# EAGLE design PiTFT32 (EAGLE 9.6.2)

## Sheet 1 of 2
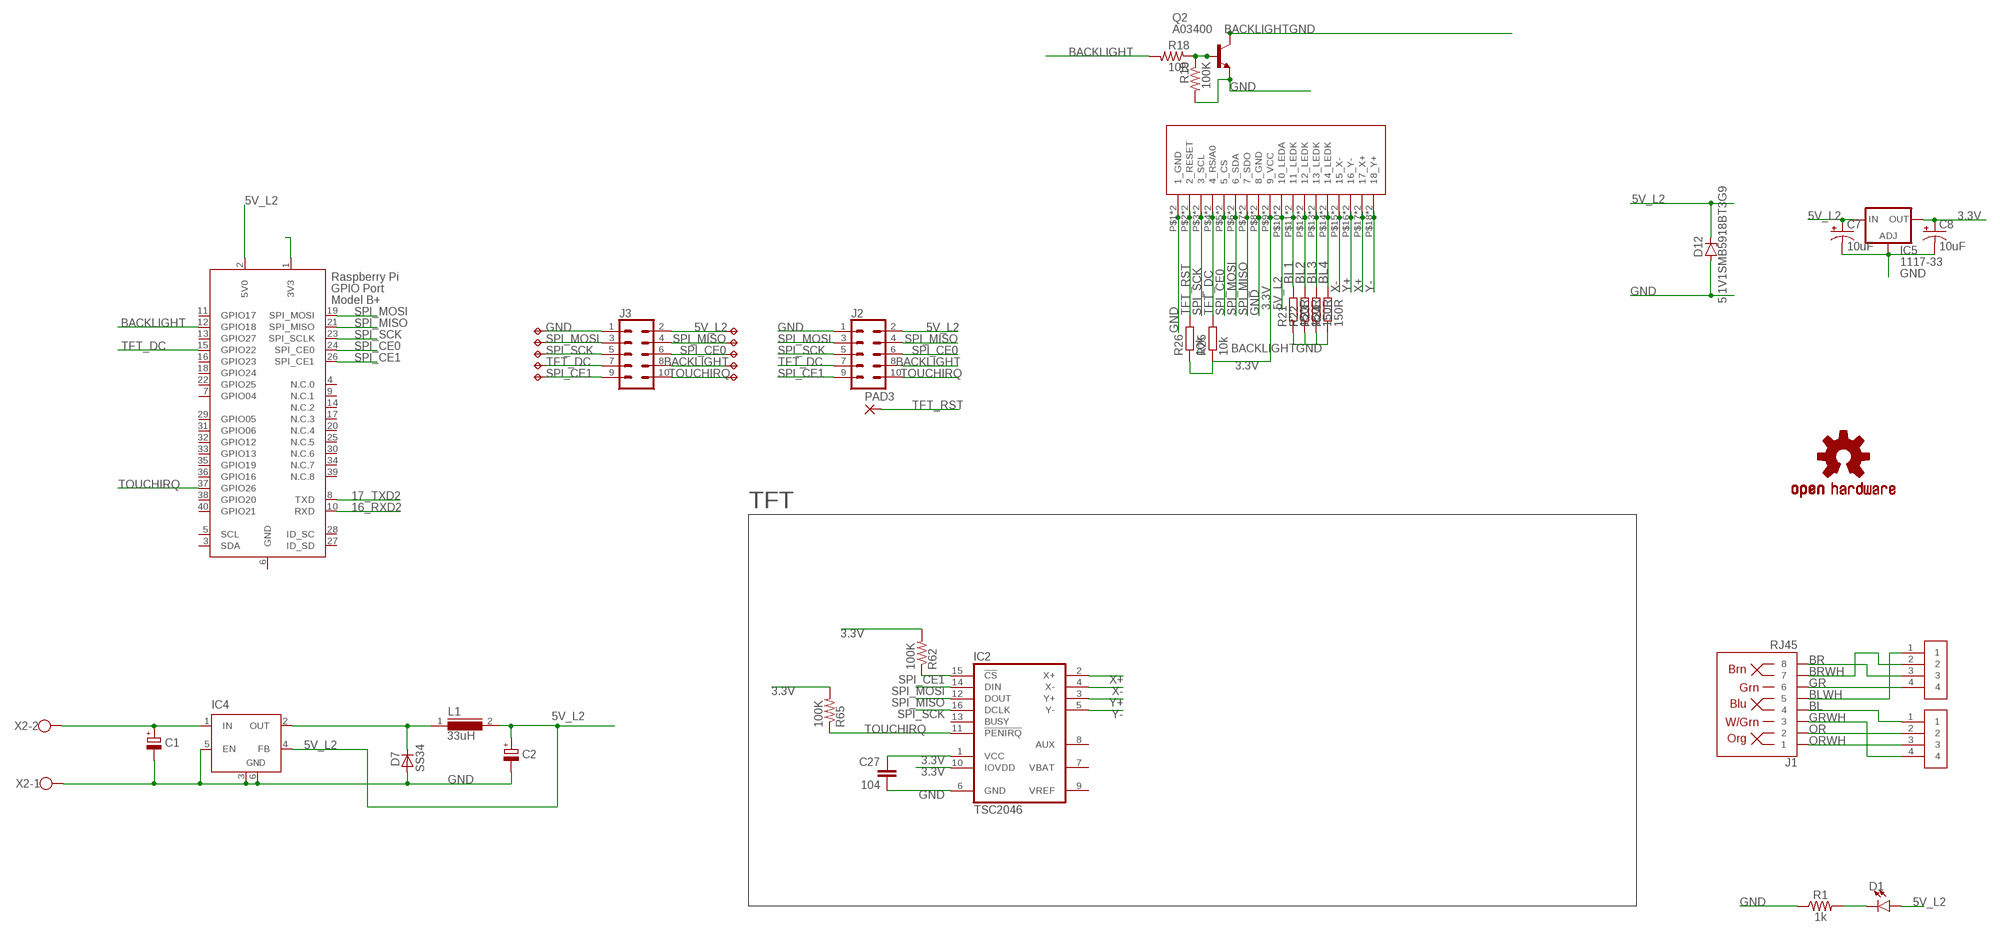
[diagram p0: schematic, sheet 1]

### Parts
C1  CPOL-EUE3.5-8  [E3,5-8]
C2  CPOL-EUE3.5-8  [E3,5-8]
C7  10uF  CAP_POL1206  [EIA3216]
C8  10uF  CAP_POL1206  [EIA3216]
C27  104  C-EUC0603K  [C0603K]
CON1  Phoenix Pluggable 3.81mm 4 way  CONNECTOR-M4  [3.81MM-4WAY-PLUGGABLE-SCREW]
CON25  Phoenix Pluggable 3.81mm 4 way  CONNECTOR-M4  [3.81MM-4WAY-PLUGGABLE-SCREW]
D1  LED5MM  [LED_5MM]
D7  SS34  D-SOD-87  [SOD87]
D12  5.1V1SMB5918BT3G9  ZENER-DIODESMB  [SMB]
IC2  TSC2046  [TSSOP16]
IC4  LM2596S  [TO263-5]
IC5  1117-33  LD117AS33TR  [SOT223]
J1  RJ45  RJ45-8  [RJ45-8]
J2  CONN_05X2SHD  [2X5-SHROUDED]
J3  CONN_05X2SHD  [2X5-SHROUDED]
L1  33uH  DR127  [DR127]
LOGO1  OSHW-LOGOM  [OSHW-LOGO-M]
PAD3  SMD5  [SMD2,54-5,08]
Q2  A03400  BC849SMD  [SOT23-BEC]
R1  1k  1KOHM-HORIZ_KIT-1/4W-5%  [AXIAL-0.3-KIT]
R18  10R  R-US_R0603  [R0603]
R19  100K  R-US_R0603  [R0603]
R21  150R  R-EU_0603-RND  [R0603-ROUND]
R22  150R  R-EU_R0603  [R0603-ROUND]
R23  150R  R-EU_R0603  [R0603-ROUND]
R24  150R  R-EU_R0603  [R0603-ROUND]
R25  10k  R-EU_R0603  [R0603-ROUND]
R26  10k  R-EU_R0603  [R0603-ROUND]
R62  100K  R-US_R0603  [R0603]
R65  100K  R-US_R0603  [R0603]
TP1  TPB1,27  [B1,27]
TP2  TPB1,27  [B1,27]
TP3  TPB1,27  [B1,27]
TP4  TPB1,27  [B1,27]
TP5  TPB1,27  [B1,27]
TP6  TPB1,27  [B1,27]
TP7  TPB1,27  [B1,27]
TP8  TPB1,27  [B1,27]
TP9  TPB1,27  [B1,27]
TP10  TPB1,27  [B1,27]
U$5  TFT-DISPLAY-3.2-OB  [TFT-DISPLAY-3.2-OB]
X1  RASPI_BOARD_B+_E0  [RASPI_BOARD_B+_EDGES_0DRILL]
X2  W237-102  [W237-102]

### Nets
3.3V: C8.A(+) C27.1 IC2.1(VCC) IC2.10(IOVDD) IC5.4(OUT) R25.1 R26.1 R62.2 R65.2 U$5.P$9(9_VCC) U$5.P$27(9_VCC)
5V_L2: C2.+ C7.A(+) D1.A D12.C IC4.4(FB) IC5.3(IN) J2.2 J3.2 L1.2 TP6.TP U$5.P$10(10_LEDA) U$5.P$28(10_LEDA) X1.2(5V0)
16_RXD2: X1.10(RXD)
17_TXD2: X1.8(TXD)
BACKLIGHT: J2.8 J3.8 R18.2 TP9.TP X1.12(GPIO18)
BACKLIGHTGND: Q2.C R21.1 R22.1 R23.1 R24.1
BL: CON1.1 J1.4
BL1: R21.2 U$5.P$11(11_LEDK) U$5.P$29(11_LEDK)
BL2: R22.2 U$5.P$12(12_LEDK) U$5.P$30(12_LEDK)
BL3: R23.2 U$5.P$13(13_LEDK) U$5.P$31(13_LEDK)
BL4: R24.2 U$5.P$14(14_LEDK) U$5.P$32(14_LEDK)
BLWH: CON25.1 J1.5
BR: CON25.3 J1.8
BRWH: CON25.2 J1.7
GND: C1.- C2.- C7.C(-) C8.C(-) C27.2 D7.2(A) D12.A IC2.6(GND) IC4.3(GND) IC4.5(EN) IC4.6(GND) IC5.1(ADJ) J2.1 J3.1 Q2.E R1.P$1 R19.2 TP1.TP U$5.P$1(1_GND) U$5.P$8(8_GND) U$5.P$19(1_GND) U$5.P$26(8_GND) X2.1
GR: CON25.4 J1.6
GRWH: CON1.4 J1.3
HI-V-IN: C1.+ IC4.1(IN) X2.2
N$1: X1.1(3V3)
N$2: D1.K(C) R1.P$2
N$3: Q2.B R18.1 R19.1
N$8: D7.1(C) IC4.2(OUT) L1.1
OR: CON1.2 J1.2
ORWH: CON1.3 J1.1
SPI_CE0: J2.6 J3.6 TP8.TP U$5.P$5(5_CS) U$5.P$23(5_CS) X1.24(SPI_CE0)
SPI_CE1: IC2.15(!CS) J2.9 J3.9 R62.1 TP5.TP X1.26(SPI_CE1)
SPI_MISO: IC2.12(DOUT) J2.4 J3.4 TP7.TP U$5.P$7(7_SDO) U$5.P$25(7_SDO) X1.21(SPI_MISO)
SPI_MOSI: IC2.14(DIN) J2.3 J3.3 TP2.TP U$5.P$6(6_SDA) U$5.P$24(6_SDA) X1.19(SPI_MOSI)
SPI_SCK: IC2.16(DCLK) J2.5 J3.5 TP3.TP U$5.P$3(3_SCL) U$5.P$21(3_SCL) X1.23(SPI_SCLK)
TFT_DC: J2.7 J3.7 R25.2 TP4.TP U$5.P$4(4_RS/A0) U$5.P$22(4_RS/A0) X1.15(GPIO22)
TFT_RST: PAD3.1(P) R26.2 U$5.P$2(2_RESET) U$5.P$20(2_RESET)
TOUCHIRQ: IC2.11(!PENIRQ) J2.10 J3.10 R65.1 TP10.TP X1.37(GPIO26)
X+: IC2.2(X+) U$5.P$17(17_X+) U$5.P$35(17_X+)
X-: IC2.4(X-) U$5.P$15(15_X-) U$5.P$33(15_X-)
Y+: IC2.3(Y+) U$5.P$16(16_Y-) U$5.P$34(16_Y-)
Y-: IC2.5(Y-) U$5.P$18(18_Y+) U$5.P$36(18_Y+)
Unconnected: IC2.7(VBAT) IC2.8(AUX) IC2.9(VREF) IC2.13(BUSY) X1.3(SDA) X1.4(N.C.0) X1.5(SCL) X1.7(GPIO04) X1.9(N.C.1) X1.11(GPIO17) X1.13(GPIO27) X1.14(N.C.2) X1.16(GPIO23) X1.17(N.C.3) X1.18(GPIO24) X1.20(N.C.4) X1.22(GPIO25) X1.25(N.C.5) X1.27(ID_SD) X1.28(ID_SC) X1.29(GPIO05) X1.30(N.C.6) X1.31(GPIO06) X1.32(GPIO12) X1.33(GPIO13) X1.34(N.C.7) X1.35(GPIO19) X1.36(GPIO16) X1.38(GPIO20) X1.39(N.C.8) X1.40(GPIO21)

### Notes on the sheet
- TFT

## Sheet 2 of 2

## Power pins joined to a net without a drawn wire
GND: X1.6(GND)

## Library data of the parts
C1 C2 = resistor:CPOL-EU: POLARIZED CAPACITOR, European symbol
C7 C8 = SparkFun:CAP_POL: Capacitor Polarized These are standard SMD and PTH capacitors. Normally 10uF, 47uF, and 100uF in electrolytic and tantalum varieties. Always verify the external diameter of the through hole cap, it varies with capacity, voltage, and manufacturer. The EIA devices should be standard.
C27 = SmartPrj:C-EU: CAPACITOR, European symbol
CON1 CON25 = openbuilds-eagle-library:CONNECTOR-M4
D1 = SparkFun-LED:LED: LED (Generic) Standard schematic elements and footprints for 5mm, 3mm, 1206, and 0603 sized LEDs. Generic LEDs with no color specified.
D7 = semicon-smd-ipc:D-: DIODE unfilled
D12 = diode:ZENER-DIODE: Z-Diode
IC2 = TSC2046:TSC2046: ADS7846 Touch Screen Controller
IC4 = linear:LM2596S: STEP-DOWN VOLTAGE REGULATOR
IC5 = v-reg:LD117A?*: Low drop fixed and adjustable positive voltage regulators 1 A Source: http://www.st.com/stonline/products/literature/ds/7194/ld1117axx.pdf
J1 = SparkFun-Connectors:RJ45-8: RJ45 Jack - 8 pin Simple RJ45, 8-pin connection. Commonly used for Cat5, Cat5e, and Cat6 Ethernet cables. Here is the connector we sell at SparkFun: RJ45 8-Pin Connector <https://www.sparkfun.com/products/643> (PRT-00643) Datasheet <https://cdn.sparkfun.com/datasheets/Prototyping/04908.pdf> It is used on this SparkFun product: SparkFun RJ45 Breakout <https://www.sparkfun.com/products/716> (BOB-00716) Note, you may also be interested in the "MAGJACK" version of this. It is basically a RJ45 connector, but also has some status LEDs built into the connector housing. You can check that out in this library at the device named "MAGJACK.dev" and see these products online: RJ45 Ethernet MagJack-Compatible <https://www.sparkfun.com/products/8534> (PRT-08534) SparkFun RJ45 MagJack Breakout <https://www.sparkfun.com/products/13021> (BOB-13021); PROD_ID: CONN-08506; SF_ID: PRT-00643
J2 J3 = SparkFun-Connectors:CONN_05X2: Multi connection point. Often used as Generic Header-pin footprint for 0.1 inch spaced/style header connections For AVR SPI programming port, see special device with nice symbol: "AVR_SPI_PROG_5x2.dev" You can populate with any combo of single row headers, but if you'd like an exact match, check these: 2x5 AVR ICSP Male Header <https://www.sparkfun.com/products/778> (PRT-00778) 2x5 Pin Shrouded Header <https://www.sparkfun.com/products/8506> (PRT-08506) On any of the 0.1 inch spaced packages, you can populate with these: Break Away Headers - Straight <https://www.sparkfun.com/products/116> (PRT-00116) Break Away Male Headers - Right Angle <https://www.sparkfun.com/products/553> (PRT-00553) Female Headers <https://www.sparkfun.com/products/115> (PRT-00115) Break Away Headers - Machine Pin <https://www.sparkfun.com/products/117> (PRT-00117) Break Away Female Headers - Swiss Machine Pin <https://www.sparkfun.com/products/743> (PRT-00743) Special note: the shrouded connector mates well with our 5x2 ribbon cables: 2x5 Pin IDC Ribbon Cable <https://www.sparkfun.com/products/8535> (PRT-08535); PROD_ID: CONN-08671; SF_ID: PRT-08506
L1 = inductors:DR127: High Power Density, High Efficiency, Shielded Inductors Source: coiltronics_dr_series.pdf
LOGO1 = SparkFun-Aesthetics:OSHW-LOGO: Open-Source Hardware (OSHW) Logo This logo indicates the piece of hardware it is found on incorporates a OSHW license and/or adheres to the definition of open source hardware found here: http://freedomdefined.org/OSHW
PAD3 = wirepad:SMD5: SMD PAD
Q2 = transistor-npn:BC849*: NPN Transistor
R1 = SparkFun-Resistors:1KOHM: 1kΩ resistor A resistor is a passive two-terminal electrical component that implements electrical resistance as a circuit element. Resistors act to reduce current flow, and, at the same time, act to lower voltage levels within circuits. - Wikipedia; PROD_ID: RES-08380
R18 R19 R62 R65 = adafruit:R-US_: RESISTOR, American symbol
R21-R26 = SmartPrj:R-EU_: RESISTOR, European symbol
TP1-TP10 = testpad:TP: Test pad
U$5 = tft32:TFT-DISPLAY-3.2-OB
X1 = raspberrypi_bastelstube_v13:RASPI_BOARD_B+: Raspberry Pi GPIO connector with markings for the outer dimensions of the Raspberry Pi board model B+ with different sets of drill holes or mounting pads
X2 = con-wago-500:W237-102: WAGO SCREW CLAMP; MPN: 237-102; OC_FARNELL: unknown; OC_NEWARK: 70K9898

## Net classes
0 default: width 0.203 mm, clearance 0.152 mm
1 power: width 0.254 mm

## Board
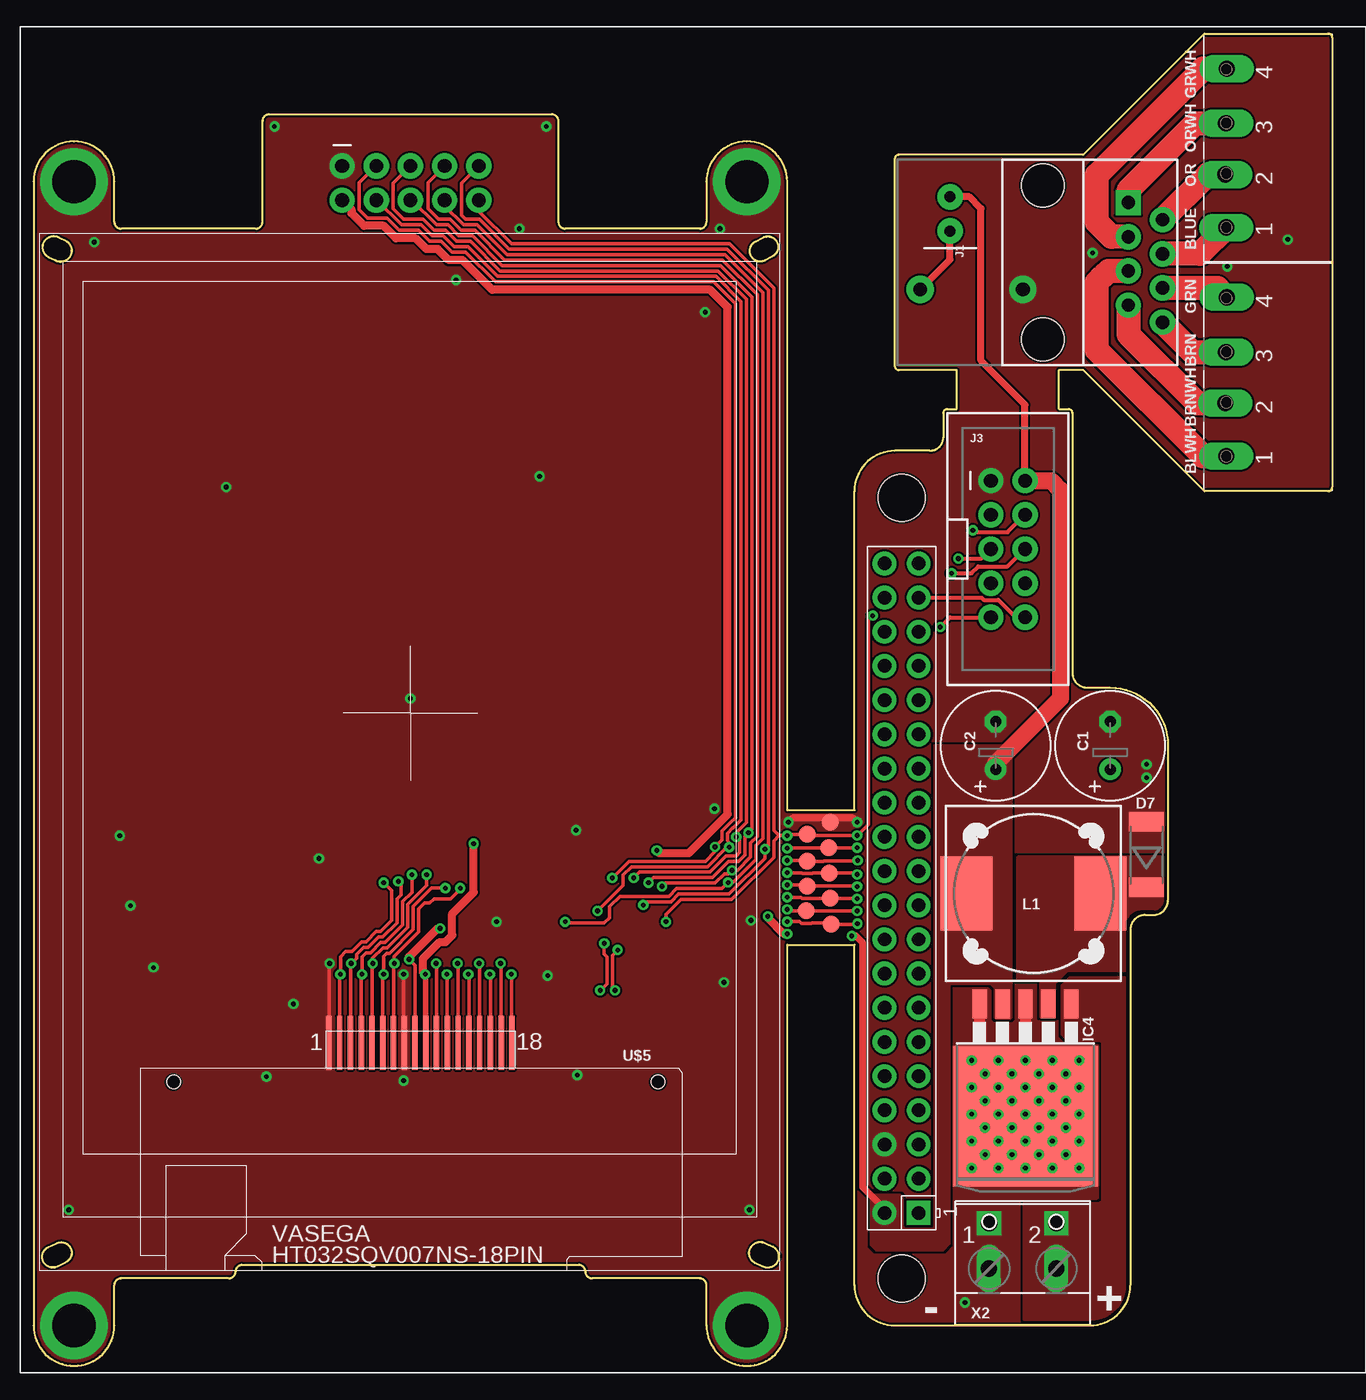
[diagram p1: board, top side]
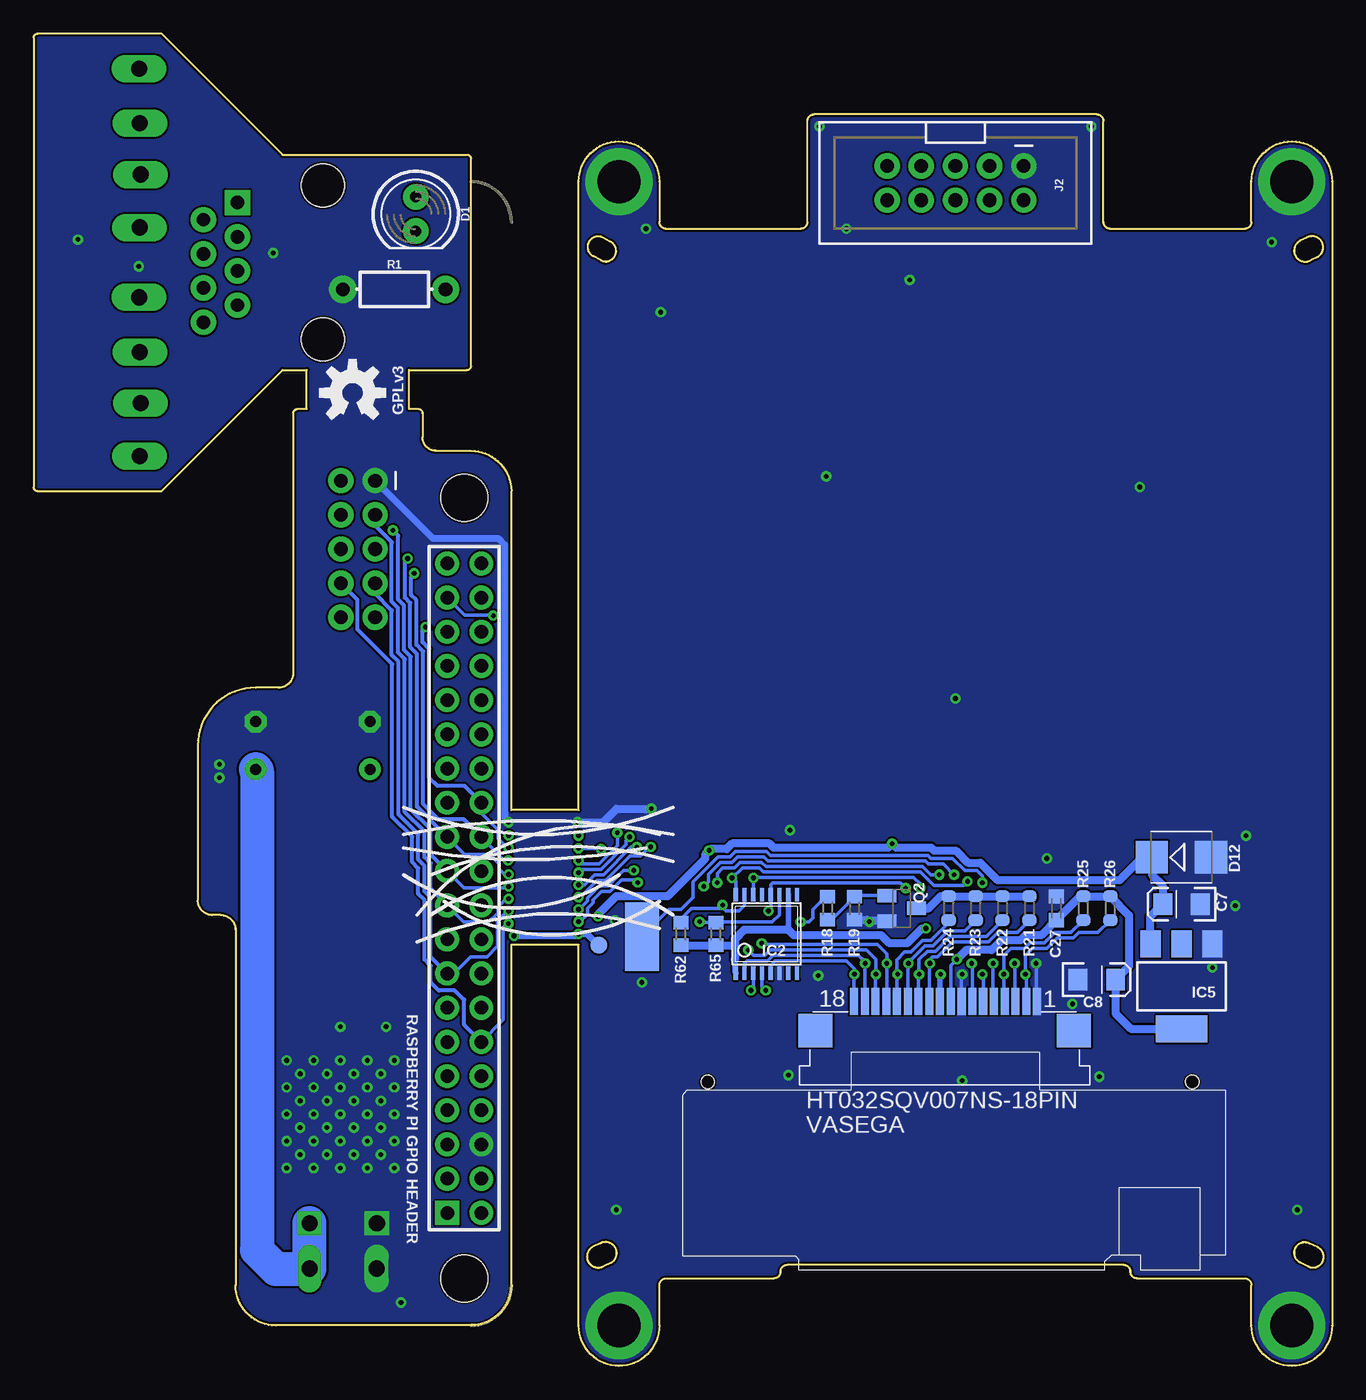
[diagram p2: board, bottom side, seen from below]

Size 96.5 x 99 mm. Coordinates in mm from the lower left corner, seen from the top.
Outline: 64,3 78.5,3 arc90 81.5,6 81.5,32.4 arc-90 82.6,33.5 83.2,33.5 arc90 84.3,34.6 84.3,46.1 arc90 80,50.4 78.3,50.4 arc-90 77.2,51.5 77.2,70.8 arc90 76.9,71.1 76.2,71.1 76.2,74 78,74 87,65 96.2,65 arc90 96.5,65.3 96.5,98.7 arc90 96.2,99 87,99 78,90 64.3,90 arc90 64,89.7 64,74.3 arc90 64.3,74 68.6,74 68.6,71.1 67.9,71.1 arc90 67.6,70.8 67.6,69 arc-90 66.6,68 64,68 arc90 61,65 61,41.3 56,41.3 56,88 arc180 50,88 50,85 arc-90 49.5,84.5 39.5,84.5 arc-90 39,85 39,92.5 arc90 38.5,93 17.5,93 arc90 17,92.5 17,85 arc-90 16.5,84.5 6.5,84.5 arc-90 6,85 6,88 arc180 0,88 0,3 arc180 6,3 6,6 arc-90 6.5,6.5 14.5,6.5 arc90 15,7 arc-90 15.5,7.5 40.5,7.5 arc-90 41,7 arc90 41.5,6.5 49.5,6.5 arc-90 50,6 50,3 arc180 56,3 56,31.3 61,31.3 61,6 arc90 64,3
Copper layers (1*16): Top 0.035mm / dielectric 1.5mm / Bottom 0.035mm
Design rules "default *": minimum track width 6mil, minimum drill 0.35mm, track to track 6mil, track to pad 6mil, pad to pad 6mil, via to via 6mil, smd to smd 6mil, copper to edge 6mil, drill to drill 6mil, minimum pad ring 10mil, minimum via ring 8mil, stop-mask expansion 4mil, vias tented up to drill 0mil, thermal gap 10mil
Holes 3.5 mm at 64.5,6.5 64.5,64.5

### Footprints (pad centres in the part's own frame; a part is rotated, then mirrored left to right if it is on the bottom)
E3,5-8 = drill 0.813 pad 1.6: + -1.778,0 | drill 0.813 pad 1.6 octagon: - 1.778,0
EIA3216 = smd 1.4 x 1.6: A 1.4,0; C -1.4,0
C0603K = smd 1.05 x 1.08: 1 -0.875,0; 2 0.875,0
3.81MM-4WAY-PLUGGABLE-SCREW = drill 1.2 pad 2.032 long: 1 5.905,-7.874; 2 1.968,-7.945; 3 -1.841,-7.889; 4 -5.905,-7.833
LED_5MM = drill 0.813 pad 1.88: A -1.27,0; K 1.27,0
SOD87 = smd 1.45 x 2.6: 1 -2.445,0; 2 2.445,0
SMB = smd 2.4 x 2.4: A 2.2,0; C -2.2,0
TSSOP16 = smd 0.305 x 0.991: 1 -2.925,-2.918; 2 -2.275,-2.918; 3 -1.625,-2.918; 4 -0.975,-2.918; 5 -0.325,-2.918; 6 0.325,-2.918; 7 0.975,-2.918; 8 1.625,-2.918; 9 1.625,2.918; 10 0.975,2.918; 11 0.325,2.918; 12 -0.325,2.918; 13 -0.975,2.918; 14 -1.625,2.918; 15 -2.275,2.918; 16 -2.925,2.918
TO263-5 = smd 1.067 x 2.159: 1 -3.404,-5.791; 2 -1.702,-5.791; 3 0,-5.791; 4 1.702,-5.791; 5 3.404,-5.791 | smd 10.8 x 10.41: 6 0,2.54
SOT223 = smd 1.5 x 2: 1 -2.3,-3.15; 2 0,-3.15; 3 2.3,-3.15 | smd 3.8 x 2: 4 0,3.15
RJ45-8 = drill 1 pad 1.88 square: 1 -4.445,6.35 | drill 1 pad 1.88: 2 -3.175,8.89; 3 -1.905,6.35; 4 -0.635,8.89; 5 0.635,6.35; 6 1.905,8.89; 7 3.175,6.35; 8 4.445,8.89 | hole 3.2: -5.715,0; 5.715,0
2X5-SHROUDED = drill 1.016 pad 1.88: 1 -1.27,5.08; 2 1.27,5.08; 3 -1.27,2.54; 4 1.27,2.54; 5 -1.27,0; 6 1.27,0; 7 -1.27,-2.54; 8 1.27,-2.54; 9 -1.27,-5.08; 10 1.27,-5.08
DR127 = smd 3.85 x 5.5: 1 -4.975,0; 2 4.975,0
SMD2,54-5,08 = smd 2.54 x 5.08: 1 0,0
SOT23-BEC = smd 1 x 1.4: B -0.95,-1.1; C 0,1.1; E 0.95,-1.1
AXIAL-0.3-KIT = drill 1.016 pad 2.032: P$1 -3.81,0; P$2 3.81,0
R0603 = smd 1 x 1.1: 1 -0.85,0; 2 0.85,0
R0603-ROUND = smd 0.898 x 1.1: 1 -0.889,0; 2 0.889,0
B1,27 = smd 1.27 x 1.27: TP 0,0
TFT-DISPLAY-3.2-OB = smd 2.5 x 2.5 bottom: MNT1 -8.8,-23.6; MNT2 10.4,-23.6 | smd 0.4 x 4: P$1 -6.06,-24.5; P$2 -5.26,-24.5; P$3 -4.46,-24.5; P$4 -3.66,-24.5; P$5 -2.86,-24.5; P$6 -2.06,-24.5; P$7 -1.26,-24.5; P$8 -0.46,-24.5; P$9 0.34,-24.5; P$10 1.14,-24.5; P$11 1.94,-24.5; P$12 2.74,-24.5; P$13 3.54,-24.5; P$14 4.34,-24.5; P$15 5.14,-24.5; P$16 5.94,-24.5; P$17 6.74,-24.5; P$18 7.54,-24.5 | smd 0.6 x 2 bottom: P$19 -6.06,-21.4; P$20 -5.26,-21.4; P$21 -4.46,-21.4; P$22 -3.66,-21.4; P$23 -2.86,-21.4; P$24 -2.06,-21.4; P$25 -1.26,-21.4; P$26 -0.46,-21.4; P$27 0.34,-21.4; P$28 1.14,-21.4; P$29 1.94,-21.4; P$30 2.74,-21.4; P$31 3.54,-21.4; P$32 4.34,-21.4; P$33 5.14,-21.4; P$34 5.94,-21.4; P$35 6.74,-21.4; P$36 7.54,-21.4 | hole 1: -17.6,-27.4; 18.4,-27.4
RASPI_BOARD_B+_EDGES_0DRILL = drill 1 pad 1.778 square: 1 8.37,51.23 | drill 1 pad 1.778: 2 8.37,53.77; 3 10.91,51.23; 4 10.91,53.77; 5 13.45,51.23; 6 13.45,53.77; 7 15.99,51.23; 8 15.99,53.77; 9 18.53,51.23; 10 18.53,53.77; 11 21.07,51.23; 12 21.07,53.77; 13 23.61,51.23; 14 23.61,53.77; 15 26.15,51.23; 16 26.15,53.77; 17 28.69,51.23; 18 28.69,53.77; 19 31.23,51.23; 20 31.23,53.77; 21 33.77,51.23; 22 33.77,53.77; 23 36.31,51.23; 24 36.31,53.77; 25 38.85,51.23; 26 38.85,53.77; 27 41.39,51.23; 28 41.39,53.77; 29 43.93,51.23; 30 43.93,53.77; 31 46.47,51.23; 32 46.47,53.77; 33 49.01,51.23; 34 49.01,53.77; 35 51.55,51.23; 36 51.55,53.77; 37 54.09,51.23; 38 54.09,53.77; 39 56.63,51.23; 40 56.63,53.77
W237-102 = drill 1.194 long: 1 -2.5,-1.27; 2 2.5,-1.27

### Placement (x,y rotation side)
C1  80,46.1 90 top
C2  71.5,46.1 90 top
C7  11.2,34.3 180 bottom
C8  17.5,28.7 0 bottom
C27  20.5,34 90 bottom
CON1  96.5,90.5 270 top
CON25  96.5,73.5 270 top
D1  68.1,85.6 270 bottom
D7  82.7,38 90 top
D12  11.2,37.8 0 bottom
IC2  41.4,32.1 0 bottom
IC4  73.7,21.1 180 top
IC5  11.2,28.2 180 bottom
J1  75,82 270 top
J2  28,87.9 270 bottom
J3  72.4,60.7 0 top
L1  74.3,35.1 180 top
LOGO1  72.8,72.3 0 bottom
PAD3  51.3,31.9 180 bottom
Q2  32,34 270 bottom
R1  69.7,80 0 bottom
R18  37.5,34 90 bottom
R19  35.5,34 270 bottom
R21  22.5,34 270 bottom
R22  24.5,34 270 bottom
R23  26.5,34 270 bottom
R24  28.5,34 270 bottom
R25  18.5,34 270 bottom
R26  16.5,34 270 bottom
R62  48.4,32.1 270 bottom
R65  45.8,32.1 270 bottom
TP1  59.2,40.4 0 top
TP2  59.2,34.75 0 top
TP3  59.12,36.62 0 top
TP4  57.42,33.81 0 top
TP5  59.1,38.5 0 top
TP6  54.52,31.25 0 bottom
TP7  57.48,35.65 0 top
TP8  57.5,37.5 0 top
TP9  59.27,32.82 0 top
TP10  57.5,39.5 0 top
U$5  28,48.5 0 top
X1  117,3 90 top
X2  73.5,8.5 0 top

### Tracks (layer width: path | path; a pad name or v marks a point on that pad's centre or on a via)
3.3V  (via drill 0.35)
  Top 0.254: U$5.P$9 28.34,29.76 v27.9,30.2
  Top 0.61: v30.2,32.5 30,32.5 27.9,30.4 v27.9,30.2
  Bottom 0.254: v27.9,30.2 28.34,29.76 U$5.P$27
  Bottom 0.406: 44.4,30.2 44.4,29.26 IC2.1 | IC2.10 40.42,32.4
  Bottom 0.61: v30.2,32.5 30.5,32.5 31.6,31.4 32.9,31.4 33.5,32 40,32 40.4,32.4 40.42,32.4 43.7,32.4 44.4,31.7 44.4,31.1 | 44.4,31.1 44.4,30.2 | 44.4,31.1 44.55,31.25 R65.2 R62.2 | v27.9,30.2 27.19,30.91 25.3,30.91 24.59,31.62 23.17,31.62 22.79,32 21.62,32 C27.1 18.74,34.89 R25.1 R26.1 15.1,33.49 15.1,29.7 C8.A 16.1,26.2 14.95,25.05 IC5.4
5V_L2  (via drill 0.35)
  Top 0.254: 29.14,29.06 v29.1,29.1
  Top 0.406: U$5.P$10 29.14,29.06
  Top 0.508: X1.2 63.23,11.67 61.6,13.3 61.6,31.45 61.1,31.95 v60.8,31.95 | J3.2 73.67,71.43 70.4,74.7 70.4,86 69.53,86.87 D1.A
  Top 0.61: v29.1,29.1 28.94,29.26 28.94,30.26 30.18,31.5 30.6,31.5 31.1,32 31.1,33.6 32.7,35.2 v32.7,38.8 | v46.3,38.3 46.5,38.1 48.68,38.1 51.57,40.99 51.57,78.68 50.28,79.97 34.08,79.97 31.87,82.18 30.85,82.18 30.04,82.99 29.18,82.99 28.38,83.8 26.92,83.8 26.01,84.72 24.56,84.72 23.62,85.66 23.62,85.93 J2.2 | v54.56,33.4 54.56,33.27 55.73,32.1 v56,32.1
  Top 1.27: J3.2 75.62,65.78 76.3,65.1 76.3,49.6 71.5,44.8 C2.+
  Bottom 0.406: v29.1,29.1 29.14,29.06 U$5.P$28
  Bottom 0.508: v60.8,31.95 60.76,32 56.1,32 v56,32.1 55.37,32.1 TP6.TP
  Bottom 0.61: IC5.3 13.5,33.4 C7.A 12.6,35.7 13.4,36.5 D12.C 14.1,37.8 15.8,36.1 24.87,36.1 26.16,37.38 27.06,37.38 27.96,38.29 29.59,38.29 29.82,38.52 32.42,38.52 v32.7,38.8 32.98,38.52 41.52,38.52 41.82,38.82 44.59,38.82 45.01,38.4 46.2,38.4 v46.3,38.3 46.6,38 46.6,37.68 49.38,34.9 53.2,34.9 54.56,33.54 v54.56,33.4
  pour Top (no thermals): 62.6,8.6 67.6,8.6 68.1,9.1 68.1,28.4 71.1,28.4 71.4,28.1 71.4,25.9 71.5,25.8 72.6,25.8 72.7,25.9 72.7,46.1 66.9,46.1 66.9,10.3 66.8,10.2 64.8,10.2 64.6,10.4 64.6,12.5 64.4,12.7 62.4,12.7 62.2,12.5 62.2,9
BACKLIGHT  (via drill 0.35)
  Top 0.254: v39.5,33 39.6,32.9 42.4,32.9 42.8,33.3 42.8,34.12 43.58,34.9 47.2,34.9 47.77,35.47 51.16,35.47 v51.61,35.91 51.96,35.91 53.69,37.63 53.69,38.67 54.19,39.17 54.19,79.76 51.36,82.59 35.16,82.59 32.96,84.79 31.93,84.79 30.54,86.19 J2.8 | v56,33.01 56.93,33.01 57.04,32.9 57.8,32.9 57.83,32.93 59.16,32.93 TP9.TP 61.17,32.82 v61.22,32.86
  Bottom 0.254: R18.2 37.55,34.8 37.7,34.8 38.6,33.9 38.6,33.3 38.9,33 v39.5,33 | X1.12 61.6,25.7 61.6,32.6 61.34,32.86 v61.22,32.86 | v51.61,35.91 51.81,36.11 52.81,36.11 53.66,35.27 54.29,35.27 54.94,34.62 54.94,34.39 55.34,33.98 55.34,33.55 55.88,33.01 v56,33.01
  Bottom 0.305: X1.12 64.5,25.34 64.5,27.2 65.2,27.9 66.4,27.9 67,28.5 67,29.73 67.46,30.19 67.46,34.62 67.91,35.08 67.91,36.98 68.37,37.43 68.37,39.33 69.84,40.8 69.84,52.14 72.42,54.73 72.42,56.91 J3.8
BACKLIGHTGND
  Bottom 0.61: Q2.C 30,34 29.11,34.89 R24.1 R23.1 R22.1 R21.1
BL
  Top 1.8: CON1.1 86.67,82.64 J1.4
BL1  (via drill 0.35)
  Top 0.254: U$5.P$11 29.94,29.86 v29.9,29.9
  Bottom 0.254: U$5.P$29 29.94,29.86 v29.9,29.9 29.9,30.2 29.71,30.39 29.33,30.39 28.23,31.49 25.54,31.49 24.84,32.2 23.41,32.2 R21.2
BL2  (via drill 0.35)
  Top 0.254: U$5.P$12 30.74,29.06 v30.7,29.1
  Bottom 0.254: U$5.P$30 30.74,29.06 v30.7,29.1 30.7,30.2 30.1,30.8 29.5,30.8 28.4,31.9 25.71,31.9 R22.2
BL3  (via drill 0.35)
  Top 0.254: U$5.P$13 31.54,29.86 v31.5,29.9
  Bottom 0.254: U$5.P$31 31.54,29.86 v31.5,29.9 31.5,29.98 30.27,31.21 29.67,31.21 28.57,32.31 27.3,32.31 R23.2
BL4  (via drill 0.35)
  Top 0.254: U$5.P$14 32.34,29.06 v32.3,29.1
  Bottom 0.254: U$5.P$32 32.34,29.06 v32.3,29.1 32.36,29.16 32.36,30.17 31.77,30.76 31.29,30.76 30.44,31.61 29.84,31.61 28.5,32.95 R24.2
BLWH
  Top 1.8: CON25.1 86.91,67.59 79,75.5 79,80.5 79.5,81 79.86,81.36 J1.5
BR
  Top 1.8: J1.8 86.1,75.34 CON25.3
BRWH
  Top 1.8: J1.7 81.35,76.65 86.47,71.53 CON25.2
GND  (via drill 0.35, 1.2, 3.2 pad 5)
  Top 0.254: U$5.P$8 27.5,24.04 v27.5,29.1 | U$5.P$1 21.94,29.84 v22,29.9
  Top 0.508: v56.09,40.4 56.39,40.7 60.9,40.7 v61.2,40.4
  Top 0.813: IC4.3 v73.7,25.2 | IC4.5 v70.3,25.2
  Bottom 0.254: v27.5,29.1 27.54,29.06 U$5.P$26 | v22,29.9 22,27.16 U$5.P$19
  Bottom 0.508: J3.1 66.85,61.5 62,61.5 61.5,61 61.5,40.7 v61.2,40.4
  Bottom 0.61: R19.2 34.55,33.15 34.45,33.05 | 34.45,33.05 v34.4,33 | Q2.E 34.45,33.05 | v56.09,40.4 54.2,40.4 53.2,41.4 v50.6,41.4
  other vias: 69.7,22.7 70.7,21.7 71.7,22.7 72.7,21.7 73.7,22.7 74.7,21.7 75.7,22.7 76.7,21.7 75.7,20.7 73.7,20.7 71.7,20.7 69.7,20.7 70.7,19.7 72.7,19.7 74.7,19.7 76.7,19.7 75.7,18.7 73.7,18.7 71.7,18.7 69.7,18.7 70.7,17.7 72.7,17.7 74.7,17.7 76.7,17.7 75.7,16.7 73.7,16.7 71.7,16.7 69.7,16.7 70.7,15.7 72.7,15.7 74.7,15.7 76.7,15.7 75.7,14.7 73.7,14.7 71.7,14.7 69.7,14.7 8.9,29.6 7.2,34.2 6.4,39.4 40.3,39.8 38.2,29 53.2,11.6 2.6,11.6 38.1,92.1 17.9,92.1 49.9,78.3 51,84.5 31.4,80.7 36.1,84.5 4.5,83.5 21.2,37.7 19.3,26.9 27.5,21.2 40.4,21.6 17.3,21.5 51.3,28.5 53.3,33.1 28,49.6 14.3,65.3 37.6,66.1 3,3 53,3 53,88 3,88 69.2,4.7 77.7,22.7 77.7,20.7 77.7,18.7 77.7,16.7 77.7,14.7 71,10.6 82.7,43.7 82.7,44.7 78.7,82.7 93.2,83.7 88.7,81.7
  pour Top (rank 6, no thermals): -1,99.5 99,99.5 99,-0.5 -1,-0.5
  pour Bottom (rank 6, no thermals): -1,99.5 99,99.5 99,-0.5 -1,-0.5
GR
  Top 1.8: CON25.4 87.98,80.09 J1.6
GRWH
  Top 1.8: J1.3 80.09,83.91 79,85 79,88.5 86.91,96.41 CON1.4
HI-V-IN  (via drill 1.2)
  Bottom 2.54: C1.+ 79.9,44.22 79.9,8.6 78.5,7.2 76.03,7.2 X2.2 v76,10.6
  pour Top (no thermals): 76.4,24.6 76.4,28.3 77,28.9 81.1,28.9 81.1,5.7 arc-80 78.6,3.4 73.6,3.4 73.6,12.1 79.2,12.1 79.4,12.3 79.4,24 79.3,24.1 76.9,24.1
N$2
  Top 0.508: R1.P$2 68.1,82.21 D1.K
N$3
  Bottom 0.254: Q2.B 35.4,34.95 R19.1 37.2,33.15 R18.1
N$8
  pour Top (no thermals): 74.8,25.9 74.8,28.6 73.1,28.6 73.1,37.8 73.2,37.9 83.9,37.9 83.9,34.5 arc-74 83.3,33.9 82.2,33.9 arc82 81.1,32.8 81.1,29.3 76.8,29.3 75.9,28.4 75.9,25.9
OR
  Top 1.8: J1.2 87.25,88.53 CON1.2
ORWH
  Top 1.8: J1.1 81.35,87.35 86.34,92.34 CON1.3
SPI_CE0  (via drill 0.35)
  Top 0.254: U$5.P$5 25.14,29.84 v25.2,29.9 25.2,30.3 25.96,31.06 26.29,31.06 27.81,32.59 27.81,34.31 29.2,35.7 v29.2,36.5 | v45.7,35.9 46.08,36.28 50.43,36.28 51.63,37.48 52.38,37.48 52.87,37.97 52.87,39.36 v53.12,39.62 53.37,39.87 53.37,79.43 51.03,81.77 34.83,81.77 32.62,83.98 31.59,83.98 30.78,84.79 29.93,84.79 28.09,86.63 J2.6 | v56,37.55 57.45,37.55 TP8.TP 58.71,37.5 58.74,37.53 61.2,37.53 v61.23,37.56
  Top 0.305: v68.22,58.9 69.7,58.9 70.2,59.41 72.38,59.41 J3.6
  Bottom 0.254: v25.2,29.9 25.2,27.16 U$5.P$23 | v45.7,35.9 45.7,36.6 45.3,37 44.43,37 44.01,37.42 42.4,37.42 42.09,37.12 30.44,37.12 29.82,36.5 v29.2,36.5 | X1.24 63.23,39.26 61.53,37.56 v61.23,37.56 | v53.12,39.62 53.12,38.68 54.5,37.3 55.73,37.3 55.75,37.3 v56,37.55
  Bottom 0.305: X1.24 64.52,40.6 66.41,40.6 67.56,41.74 67.56,53.09 68.06,53.59 68.06,56.89 68.45,57.28 68.45,58.67 v68.22,58.9
SPI_CE1  (via drill 0.35)
  Top 0.254: J2.9 31.8,87.89 31.8,85.5 32.1,85.2 33.12,85.2 35.33,82.99 51.53,82.99 54.59,79.93 54.59,38.65 v54.34,38.4 54.34,37.72 51.69,35.06 47.94,35.06 47.37,34.49 45.55,34.49 v45.3,34.24 | v56,38.46 56.04,38.5 TP5.TP v61.2,38.5
  Top 0.305: v67.37,54.9 68.09,55.62 J3.9
  Bottom 0.254: IC2.15 43.67,34.23 44.1,33.8 45.06,33.8 45.26,34 | R62.1 48.4,33.2 47.6,34 45.26,34 | v45.3,34.24 45.3,34.04 45.26,34 | X1.26 63.23,41.05 62,39.82 62,39.2 61.3,38.5 v61.2,38.5 | v54.34,38.4 54.4,38.46 v56,38.46
  Bottom 0.305: X1.26 64.48,43.1 66.5,43.1 67.1,43.7 67.1,53.28 67.6,53.78 67.6,54.67 v67.37,54.9
SPI_MISO  (via drill 0.35)
  Top 0.254: U$5.P$7 26.74,29.84 v26.8,29.9 26.8,30.43 28.62,32.25 28.62,33.97 29.04,34.39 29.44,34.39 29.74,34.69 30.99,34.69 31.7,35.4 v31.7,35.5 | v41.9,33.8 43.8,35.7 43.8,36.48 44.41,37.09 50.09,37.09 51.54,38.54 v51.69,38.54 51.69,38.9 51.56,39.03 51.56,39.57 51.94,39.96 51.96,39.96 52.56,40.56 52.56,79.09 50.69,80.96 34.49,80.96 32.28,83.17 31.26,83.17 30.45,83.98 29.59,83.98 28.78,84.79 27.33,84.79 25.5,86.63 J2.4 | v56,35.73 57.4,35.73 TP7.TP 58.81,35.65 58.82,35.66 61.15,35.66 v61.2,35.62
  Top 0.305: v69.8,62.1 69.95,61.95 72.38,61.95 J3.4
  Bottom 0.254: v26.8,29.9 26.74,29.84 U$5.P$25 | v31.7,35.5 32.1,35.9 41.6,35.9 41.73,35.77 IC2.12 41.73,33.98 v41.9,33.8 | X1.21 64.5,35.5 61.32,35.5 v61.2,35.62 | v51.69,38.54 52.11,38.54 54.16,36.49 54.81,36.49 55.56,35.73 v56,35.73
  Bottom 0.305: X1.21 67,38 67,39.89 68.47,41.37 68.47,52.71 68.97,53.21 68.97,56.51 69.4,56.94 69.4,61.7 v69.8,62.1
SPI_MOSI  (via drill 0.35)
  Top 0.254: U$5.P$6 25.94,29.04 v26,29.1 26,30.43 26.23,30.66 26.45,30.66 28.21,32.42 28.21,34.14 29.57,35.5 v30.6,35.5 | J2.3 24.2,87.91 24.2,85.9 24.8,85.3 26.25,85.3 27.16,84.39 28.61,84.39 29.43,83.57 30.28,83.57 31.09,82.76 32.12,82.76 34.32,80.56 50.52,80.56 52.16,78.92 52.16,40.73 51.79,40.36 51.77,40.36 51.15,39.74 51.15,39.08 v50.63,38.56 50.63,38.21 49.92,37.5 44.24,37.5 v43,36.26 | v56,34.83 57.01,34.83 57.1,34.74 57.86,34.74 57.87,34.75 TP2.TP 61.16,34.75 v61.2,34.71
  Bottom 0.254: v26,29.1 25.94,29.04 U$5.P$24 | v30.6,35.5 30.6,35.8 31.11,36.31 42.95,36.31 v43,36.26 43,35.04 IC2.14 | X1.19 64.54,33 62.67,33 62,33.67 62,34.1 61.39,34.71 v61.2,34.71 | v50.63,38.56 50.73,38.56 51.41,37.88 52.19,37.88 53.99,36.08 54.62,36.08 55.88,34.83 v56,34.83
  Bottom 0.305: X1.19 67,35.46 67,37.35 67.46,37.81 67.46,39.7 68.93,41.18 68.93,52.52 69.43,53.02 69.43,56.33 69.89,56.78 69.89,61.22 71.13,62.46 J3.3
SPI_SCK  (via drill 0.35)
  Top 0.254: U$5.P$3 23.54,29.84 v23.6,29.9 23.99,30.29 23.99,30.57 24.53,31.11 24.86,31.11 25.63,31.88 25.95,31.88 26.99,32.92 26.99,34.69 27.3,35 27.3,35.8 v27.1,36 | J2.5 26.7,87.87 26.7,86 27.5,85.2 28.95,85.2 29.76,84.39 30.61,84.39 31.43,83.57 32.45,83.57 34.66,81.37 50.86,81.37 52.97,79.26 52.97,40.39 52.21,39.64 v52.21,39.3 52.47,39.05 52.47,38.14 52.21,37.88 51.46,37.88 50.26,36.69 45.03,36.69 v44.6,36.26 | v61.2,36.53 61.11,36.62 TP3.TP 57.91,36.62 57.88,36.59 57.12,36.59 57.06,36.64 v56,36.64
  Top 0.305: v68.72,60 70.43,60 J3.5
  Bottom 0.254: v23.6,29.9 23.6,27.16 U$5.P$21 | IC2.16 44.33,35.98 v44.6,36.26 43.84,37.01 42.56,37.01 42.26,36.71 30.61,36.71 29.6,35.7 27.4,35.7 v27.1,36 | X1.23 64.46,38 62.6,38 61.9,37.3 61.9,36.93 61.5,36.53 v61.2,36.53 | v52.21,39.3 52.47,39.05 52.47,38.76 54.33,36.89 55.75,36.89 v56,36.64
  Bottom 0.305: X1.23 68.01,41.55 68.01,52.9 68.51,53.4 68.51,56.7 68.91,57.09 68.91,59.81 v68.72,60
TFT_DC  (via drill 0.35)
  Top 0.254: U$5.P$4 24.34,29.04 v24.4,29.1 24.4,30.4 24.7,30.7 25.02,30.7 25.8,31.47 26.12,31.47 27.4,32.75 27.4,34.5 27.43,34.5 28.11,35.19 28.11,36.49 v28.1,36.5 | J2.7 29.3,87.93 29.3,86 30.1,85.2 30.95,85.2 31.76,84.39 32.79,84.39 34.99,82.18 51.2,82.18 53.78,79.59 53.78,39.34 53.28,38.84 53.28,37.8 52.3,36.82 v51.9,36.82 51.65,36.57 51.34,36.57 50.64,35.87 46.95,35.87 v46.7,35.62 | v56,33.92 56.11,33.81 TP4.TP v61.19,33.81 v61.2,33.8
  Bottom 0.254: U$5.P$22 24.4,27.16 v24.4,29.1 24.4,30.5 23.87,31.03 22.87,31.03 22.48,31.42 21.38,31.42 20.6,32.2 19.41,32.2 R25.2 | v46.7,35.62 46.36,35.97 46.36,36.52 45.47,37.41 44.6,37.41 44.18,37.83 42.23,37.83 41.93,37.53 30.23,37.53 30,37.3 28.9,37.3 v28.1,36.5 | X1.15 65.27,29.15 64.02,30.4 62.8,30.4 62.01,31.19 62.01,33.09 61.3,33.8 v61.2,33.8 | v51.9,36.82 52.68,36.82 53.83,35.67 54.46,35.67 55.34,34.79 55.34,34.55 55.98,33.92 v56,33.92
  Bottom 0.305: X1.15 67,30.38 67,34.81 67.46,35.27 67.46,37.16 67.91,37.62 67.91,39.52 69.39,40.99 69.39,52.33 69.89,52.83 69.89,56.14 71.13,57.38 J3.7
TFT_RST  (via drill 0.35)
  Top 0.254: U$5.P$2 22.74,29.04 v22.8,29.1 22.8,30.4 23.2,30.8 23.65,30.8 24.36,31.51 24.69,31.51 25.46,32.28 25.78,32.28 26.59,33.09 26.59,35.31 v26,35.9
  Bottom 0.254: U$5.P$20 22.74,29.04 v22.8,29.1 22.8,30.5 22.29,31.01 21.21,31.01 20.43,31.79 19.24,31.79 18.84,32.2 17.41,32.2 R26.2 | v26,35.9 26,36.4 26.4,36.8 27.3,36.8 28.21,37.71 29.83,37.71 30.06,37.93 41.76,37.93 42.06,38.23 44.35,38.23 44.77,37.81 45.64,37.81 47.5,35.95 47.5,34.8 48.4,33.9 49.3,33.9 PAD3.1
TOUCHIRQ  (via drill 0.35)
  Top 0.254: v47,33 47,33.55 48.1,34.66 51.85,34.66 55,37.8 55,39 55.4,39.4 | J2.10 33.08,85.82 35.5,83.4 51.7,83.4 55,80.1 55,39.8 55.4,39.4 | v62.35,55.75 62.03,55.43 62.03,40.24 v61.2,39.41 59.48,39.41 57.59,39.41 TP10.TP 56.1,39.5 v56,39.4 55.4,39.4
  Top 0.305: X1.37 70.44,57.09 70.61,56.91 71.69,56.91 72.98,55.62 J3.10
  Bottom 0.254: IC2.11 41.08,33.52 41.62,32.98 45.77,32.98 R65.1 46.95,32.95 v47,33 | X1.37 64.48,55.8 62.4,55.8 v62.35,55.75
X+  (via drill 0.35)
  Top 0.254: U$5.P$17 34.74,29.86 v34.7,29.9
  Bottom 0.254: U$5.P$35 34.74,29.86 v34.7,29.9 34.7,30 35.2,30.5 41.57,30.5 41.98,30.1 43.5,30.1 43.67,29.93 IC2.2
X-  (via drill 0.35)
  Top 0.254: U$5.P$15 33.14,29.86 v33.1,29.9 | v42.4,31.4 42.4,30.6 42.59,30.41 42.59,28.39 v42.1,27.9
  Bottom 0.254: U$5.P$33 33.1,27.14 v33.1,29.9 33.1,30.62 33.8,31.32 42.32,31.32 v42.4,31.4 | v42.1,27.9 42.38,28.18 IC2.4
Y+  (via drill 0.35)
  Top 0.254: U$5.P$16 33.94,29.06 v33.9,29.1 | v43.4,30.9 43,30.5 43,28.1 v43.2,27.9
  Bottom 0.254: U$5.P$34 33.94,29.06 v33.9,29.1 33.9,30.21 34.6,30.91 41.74,30.91 42.14,30.51 43.01,30.51 v43.4,30.9 | v43.2,27.9 43.02,28.07 IC2.3
Y-  (via drill 0.35)
  Top 0.254: U$5.P$18 35.5,24.04 v35.5,29.1
  Bottom 0.254: U$5.P$36 35.54,29.06 v35.5,29.1 35.5,29.5 36.1,30.1 41.4,30.1 41.73,29.77 IC2.5

### Text on the board
tPlace: GRWH | ORWH | OR | BLUE | GRN | BRN | BRNWH | BLWH | - | +
bPlace: GPLv3 | RASPBERRY PI GPIO HEADER
tStop: RASPBERRY PI LCD ILI9341 WITH TOUCH TP2046 | DESIGNED BY PETER VAN DER WALT (2021)